# Altium schematic sheet Shuttler_AFE_Channel.SchDoc: Shuttler AFE
size 420 x 297 mm; Author: G.Kasprowicz; CompanyName: WUT ISE; DrawnBy: G.Kasprowicz; Organization: WUT ISE; Address1: PW ISE; Address2: Nowowiejska 15/19 00-665 Warsaw; Address3: gkasprow@gmail.com; DocumentNumber: 5; SheetNumber: 5; SheetTotal: 6; ModifiedBy: -; CheckedDate: -; Title2: Channel; DivGrp: WUT ISE; Designer: G.Kasprowicz; ModifiedDate: -; ProjectName: Sensor Box
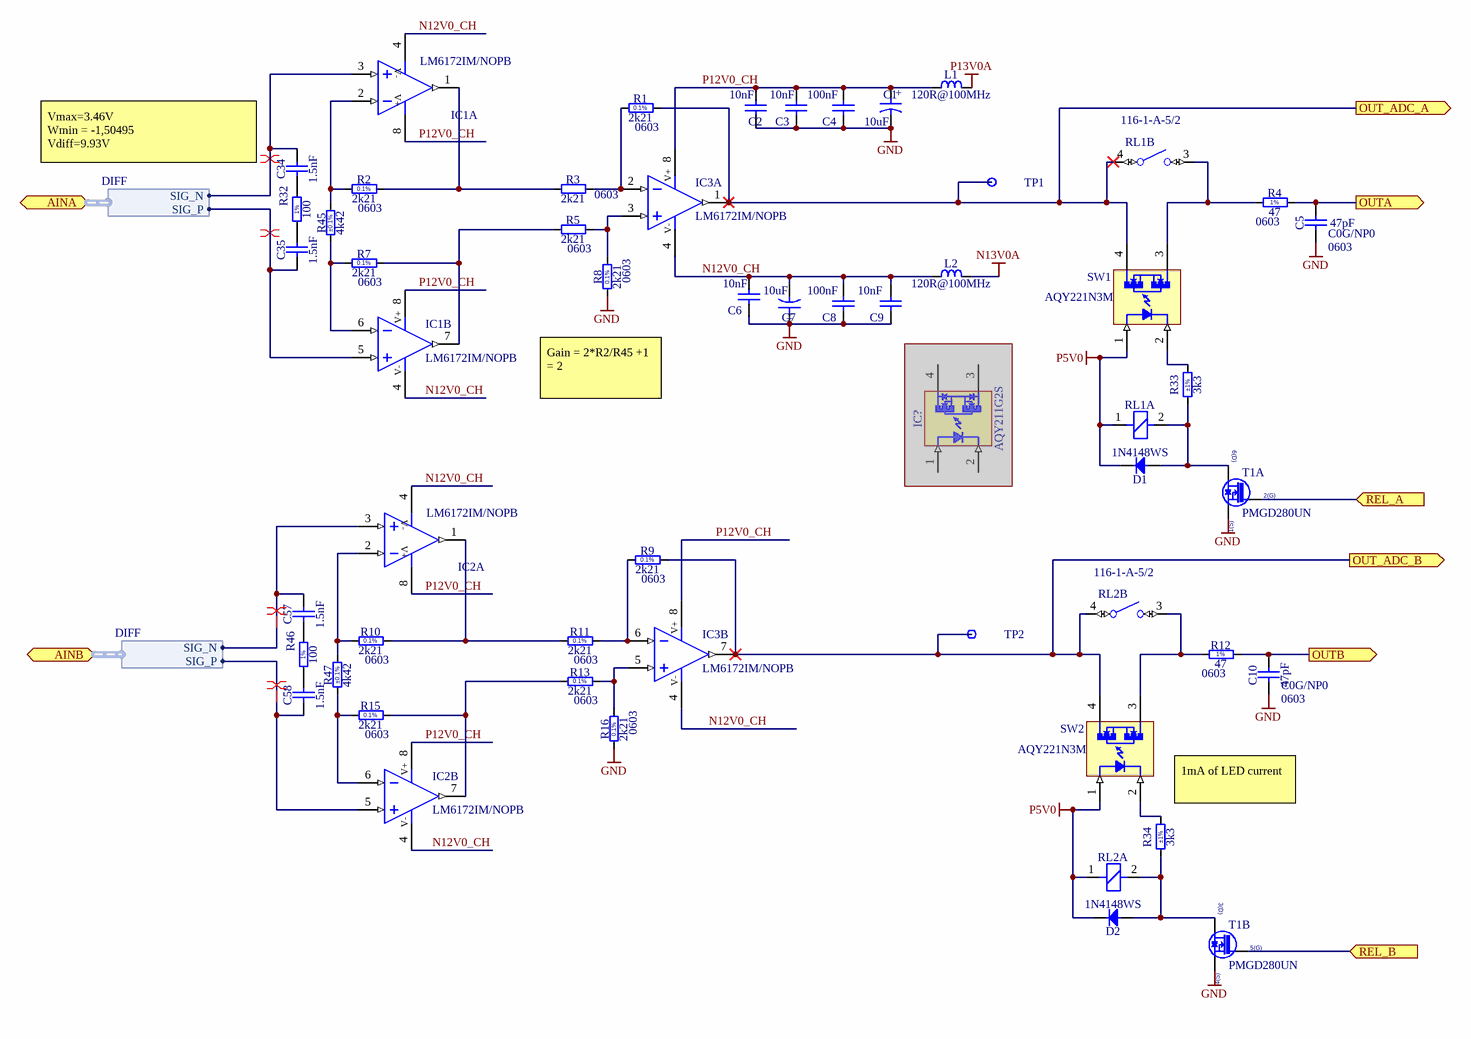
[diagram p0: Shuttler_AFE_Channel.SchDoc]

## Parts
C1  10uF  [CAPMP3216X180N]
C2  10nF  [CAPC1005X55N]
C3  10nF  [CAPC1005X55N]
C4  100nF  [CAPC1005X55N]
C5  47pF  TC: C0G/NP0  Case: 0603  [CAPC1608X87N]
C6  10nF  [CAPC1005X55N]
C7  10uF  [CAPMP3216X180N]
C8  100nF  [CAPC1005X55N]
C9  10nF  [CAPC1005X55N]
C10  47pF  TC: C0G/NP0  Case: 0603  [CAPC1608X87N]
C34  1.5nF  [CAPC1608X87N]
C35  1.5nF  [CAPC1608X87N]
C57  1.5nF  [CAPC1608X87N]
C58  1.5nF  [CAPC1608X87N]
D1  1N4148WS  [SODFL2512X100N]
D2  1N4148WS  [SODFL2512X100N]
IC1  LM6172IM/NOPB  [SOIC127P600X175-8N]  (parts A,B of 2)
IC2  LM6172IM/NOPB  [SOIC127P600X175-8N]  (parts A,B of 2)
IC3  LM6172IM/NOPB  [SOIC127P600X175-8N]  (parts A,B of 2)
IC?  AQY211G2S  [PANASONIC_AQY21(SOP)]  (masked out: inside a compile mask, not in the netlist)
L1  120R@100MHz  [INDC1608X95N]
L2  120R@100MHz  [INDC1608X95N]
R1  2k21  Case: 0603  [RESC1608X55N]
R2  2k21  Case: 0603  [RESC1608X55N]
R3  2k21  Case: 0603  [RESC1608X55N]
R4  47  Case: 0603  [RESC1608X55N]
R5  2k21  Case: 0603  [RESC1608X55N]
R7  2k21  Case: 0603  [RESC1608X55N]
R8  2k21  Case: 0603  [RESC1608X55N]
R9  2k21  Case: 0603  [RESC1608X55N]
R10  2k21  Case: 0603  [RESC1608X55N]
R11  2k21  Case: 0603  [RESC1608X55N]
R12  47  Case: 0603  [RESC1608X55N]
R13  2k21  Case: 0603  [RESC1608X55N]
R15  2k21  Case: 0603  [RESC1608X55N]
R16  2k21  Case: 0603  [RESC1608X55N]
R32  100  [RESC1608X55N]
R33  3k3  Tolerance: ±1%  [RESC1005X40N]
R34  3k3  Tolerance: ±1%  [RESC1005X40N]
R45  4k42  Tolerance: ±0.1%  [RESC1608X55N]
R46  100  [RESC1608X55N]
R47  4k42  Tolerance: ±0.1%  [RESC1608X55N]
RL1  REL_PICKERING_116-1-A-5/2  [REL_PICKERING_116-1-A]  (value not drawn)  (parts A,B of 2)
RL2  REL_PICKERING_116-1-A-5/2  [REL_PICKERING_116-1-A]  (value not drawn)  (parts A,B of 2)
SW1  AQY221N3M  [PANASONIC_AQY22(SON)]
SW2  AQY221N3M  [PANASONIC_AQY22(SON)]
T1  PMGD280UN  [SOT65P210X110-6N]  (parts A,B of 2)
TP1  Test Point  [TPS127]  (value not drawn)  (no BOM)
TP2  Test Point  [TPS127]  (value not drawn)  (no BOM)

## Ports
AINA (bidir, harness DIFF), AINB (bidir, harness DIFF), OUT_ADC_A (out), OUT_ADC_B (out), OUTA (out), OUTB (out), REL_A (in), REL_B (in)

## Harnesses
DIFF: SIG_P, SIG_N

## Nets
GND: C1.2 C2.2 C3.2 C4.2 C5.1 C6.2 C7.1 C8.2 C9.2 C10.1 R8.1 R16.1 T1.1(S) T1.4(S)
N13V0A: L2.2
P5V0: D1.1(C) D2.1(C) RL1.1(BO) RL2.1(BO) SW1.1(A) SW2.1(A)
P13V0A: L1.2
N12V0_CH: C6.1 C7.2 C8.1 C9.1 IC1.4(V-) IC2.4(V-) IC3.4(V-) L2.1
OUT_ADC_A: IC3.1(OUT) R1.2 RL1.4(C) SW1.4(E) TP1.1 ; port OUT_ADC_A
OUT_ADC_B: IC3.7(OUT) R9.2 RL2.4(C) SW2.4(E) TP2.1 ; port OUT_ADC_B
OUTA: C5.2 R4.2 ; port OUTA
OUTB: C10.2 R12.2 ; port OUTB
P12V0_CH: C1.1 C2.1 C3.1 C4.1 IC1.8(V+) IC2.8(V+) IC3.8(V+) L1.1
REL_A: T1.2(G) ; port REL_A
REL_B: T1.5(G) ; port REL_B
NetC34_1: C34.1 R32.2
NetC34_2: C34.2 IC1.3(IN+) ; port AINA.SIG_N
NetC35_1: C35.1 IC1.5(IN+) ; port AINA.SIG_P
NetC35_2: C35.2 R32.1
NetC57_1: C57.1 R46.2
NetC57_2: C57.2 IC2.3(IN+) ; port AINB.SIG_N
NetC58_1: C58.1 IC2.5(IN+) ; port AINB.SIG_P
NetC58_2: C58.2 R46.1
NetD1_2: D1.2(A) R33.1 RL1.2(BO) T1.6(D)
NetD2_2: D2.2(A) R34.1 RL2.2(BO) T1.3(D)
NetIC1_1: IC1.1(OUT) R2.2 R3.1
NetIC1_2: IC1.2(IN-) R2.1 R45.2
NetIC1_6: IC1.6(IN-) R7.1 R45.1
NetIC1_7: IC1.7(OUT) R5.1 R7.2
NetIC2_1: IC2.1(OUT) R10.2 R11.1
NetIC2_2: IC2.2(IN-) R10.1 R47.2
NetIC2_6: IC2.6(IN-) R15.1 R47.1
NetIC2_7: IC2.7(OUT) R13.1 R15.2
NetIC3_2: IC3.2(IN-) R1.1 R3.2
NetIC3_3: IC3.3(IN+) R5.2 R8.2
NetIC3_5: IC3.5(IN+) R13.2 R16.2
NetIC3_6: IC3.6(IN-) R9.1 R11.2
NetR4_1: R4.1 RL1.3(NO) SW1.3(C)
NetR12_1: R12.1 RL2.3(NO) SW2.3(C)
NetR33_2: R33.2 SW1.2(K)
NetR34_2: R34.2 SW2.2(K)

## Layout directives
differential pair: NetC34_2, NetC35_1, NetC57_2, NetC58_1

## Notes on the sheet
- Vmax=3.46V
  Wmin = -1,50495
  Vdiff=9.93V
- (near R8) Gain = 2*R2/R45 +1 = 2
- 1mA of LED current
- Project/Equipment
- Document
- Designer
- Drawn by
- Check.by
- Copyright WUT ISE 2020.
  This documentation describes Open Hardware and is licensed under the CERN OHL v.1.2. You may redistribute and modify this documentation under the terms of the CERN OHL v.1.2. (http://ohwr.org/CERNOHL). This documentation is distributed WITHOUT ANY EXPRESS OR IMPLIED WARRANTY, INCLUDING OF MERCHANTABILITY, SATISFACTORY QUALITY AND FITNESS FOR A PARTICULAR PURPOSE. Please see the CERN OHL v.1.2 for applicable conditions.
- Contact
- File
- Last Mod.
- Print Date
- Sheet
- Size
- A3
- of
- Rev
- (in symbol CTE3216-18_10UF_10V_10%_LESR1800) +
- (in symbol PMGD280UN, part A) 6(D); 2(G); 1(S)
- (in symbol PMGD280UN, part B) 3(D); 5(G); 4(S)
- (in symbol R0603_2K21_0.1%_0.063W_10PPM) 0.1%
- (in symbol R0603_47R_1%_0.1W_100PPM) 1%
- (in symbol R0603_100R_1%_0.1W_100PPM) 1%

## Library data of the parts
C1 C7 = CTE3216-18_10UF_10V_10%_LESR1800: Polarised capacitor; Part Description: Low ESR 1R8 Solid Tantalum Chip Capacitor; Manufacturer: GENERIC; Manufacturer1 Part Number: TPSA106K010R1800; Voltage: 10V; Tolerance: ±10%; Part Number: CTE3216-18_10UF_10V_10%_LESR1800; Component Kind: Standard; Component Type: Standard; Pin Count: 2; Value: 10uF; Status: Preferred; Manufacturer Part Number: CTE3216-18_10UF_10V_10%_LESR1800; Case: A; Mounted: Yes; Socket: No; SMD: Yes; Sense: No; Manufacturer1 Example: AVX; Manufacturer1 ComponentHeight: 1.8mm; HelpURL: \\cern.ch\dfs\Applications\Altium\Datasheets\CTE-LESR_AVX_TPS.pdf; Author: CERN DEM JLC; CreateDate: 05.05.2008; LatestRevisionDate: 20.01.2009
C2 C3 C6 C9 = CC0402_10NF_16V_10%_X7R: Non-polarised capacitor; Part Description: SMD Multilayer Chip Ceramic Capacitor; Manufacturer: GENERIC; Manufacturer1 Part Number: 223878715636; Voltage: 16V; TC: X7R; Tolerance: ±10%; Part Number: CC0402_10NF_16V_10%_X7R; Component Kind: Standard; Component Type: Standard; Pin Count: 2; Value: 10nF; Status: Not Recommended; Manufacturer Part Number: CC0402_10NF_16V_10%_X7R; Case: 0402; Mounted: Yes; Socket: No; SMD: Yes; Sense: No; Manufacturer1 Example: PHYCOMP; Manufacturer1 ComponentHeight: 0.55mm; HelpURL: \\cern.ch\dfs\Applications\Altium\Datasheets\CC0402_X7R_PHYCOMP.pdf; Author: CERN DEM JLC; CreateDate: 03.12.2007; LatestRevisionDate: 03.12.2007
C4 C8 = CC0402_100NF_16V_10%_X5R: Non-polarised capacitor; Part Description: SMD Multilayer Chip Ceramic Capacitor; Manufacturer: GENERIC; Manufacturer1 Part Number: GRM155R61C104KA88D; Voltage: 16V; TC: X5R; Tolerance: ±10%; Part Number: CC0402_100NF_16V_10%_X5R; Component Kind: Standard; Component Type: Standard; Pin Count: 2; Value: 100nF; Status: None; Manufacturer Part Number: CC0402_100NF_16V_10%_X5R; Case: 0402; Mounted: Yes; Socket: No; SMD: Yes; Sense: No; Manufacturer1 Example: MURATA; Manufacturer1 ComponentHeight: 0.55mm; HelpURL: \\cern.ch\dfs\Applications\Altium\Datasheets\CC0402_X5R_MURATA_GRM.pdf; Author: CERN DEM JLC; CreateDate: 10.12.2013; LatestRevisionDate: 10.12.2013
C5 C10 = CC0603_47PF_50V_5%_NP0: Non-polarised capacitor; Part Description: SMD Multilayer Chip Ceramic Capacitor; Manufacturer: GENERIC; Manufacturer1 Part Number: 223886715479; Voltage: 50V; Tolerance: ±5%; Part Number: CC0603_47PF_50V_5%_NP0; Component Kind: Standard; Component Type: Standard; Pin Count: 2; Value: 47pF; Status: Preferred; Manufacturer Part Number: CC0603_47PF_50V_5%_NP0; Mounted: Yes; Socket: No; SMD: Yes; Sense: No; Manufacturer1 Example: PHYCOMP; Manufacturer1 ComponentHeight: 0.87mm; HelpURL: \\cern.ch\dfs\Applications\Altium\Datasheets\CC0603_NP0_PHYCOMP.pdf; Author: CERN DEM JLC; CreateDate: 03.12.2007; LatestRevisionDate: 03.12.2007
C34 C35 C57 C58 = CC0603_1.5NF_50V_5%_NP0: Non-polarised capacitor; Part Description: SMD Multilayer Chip Ceramic Capacitor; Manufacturer: GENERIC; Manufacturer1 Part Number: GRM1885C1H152JA01D; Voltage: 50V; TC: C0G/NP0; Tolerance: ±5%; Part Number: CC0603_1.5NF_50V_5%_NP0; Component Kind: Standard; Component Type: Standard; Pin Count: 2; Value: 1.5nF; Status: None; Manufacturer Part Number: CC0603_1.5NF_50V_5%_NP0; Case: 0603; Mounted: Yes; Socket: No; SMD: Yes; Sense: No; Manufacturer1 Example: MURATA; Manufacturer1 ComponentHeight: 0.9mm; HelpURL: \\cern.ch\dfs\Applications\Altium\Datasheets\CC0603_NP0_MURATA.pdf; Author: CERN DEM JLC; CreateDate: 08.02.2011; LatestRevisionDate: 08.02.2011
D1 D2 = 1N4148WS: Diode; Part Description: Small Signal Diodes; Manufacturer: FAIRCHILD SEMICONDUCTOR; Voltage: 75V; Power: 150mA; PressFit: No; Bonding: No; Part Number: 1N4148WS; Component Kind: Standard; Component Type: Standard; Device: 1N4148WS; PackageDescription: SODFL Diode (SOD323F); 1.70mm W X 1.25mm L X 1.00mm H body, IPC Medium Density; Manufacturer Part Number: 1N4148WS; Pin Count: 2; Case: SOD-323F; Mounted: Yes; Socket: No; SMD: Yes; Sense: No; ComponentHeight: 1mm; HelpURL: \\cern.ch\dfs\Applications\Altium\Datasheets\1N4148WS.pdf; Author: CERN DEM JLC; CreateDate: 12.05.2011; LatestRevisionDate: 12.05.2011
IC1-IC3 = LM6172IM/NOPB: Dual Operational Amplifier; Part Description: Dual High Speed, Low Power, Low Distortion Voltage Feedback Amplifiers; Manufacturer: TEXAS INSTRUMENTS; PressFit: No; Bonding: No; Part Number: LM6172IM/NOPB; Component Kind: Standard; Component Type: Standard; Device: LM6172IM/NOPB; PackageDescription: SOIC 8, Pitch 1.27mm - Body 4x5mm, IPC Medium Density; Manufacturer Part Number: LM6172IM/NOPB; Pin Count: 8; Case: SOIC8; Mounted: Yes; Socket: No; SMD: Yes; Sense: No; ComponentHeight: 1.75mm; Author: CERN DEM MR; HelpURL: \\cern.ch\dfs\Applications\Altium\Datasheets\LM6172IM-NOPB.pdf; CreateDate: 08.08.2019; LatestRevisionDate: 08.08.2019
IC? = AQY211G2S: PhotoMOS Relay; Part Description: GU 1 Form A, PhotoMOS Relay, High Capacity, 40V 1.6A; Manufacturer: PANASONIC; PressFit: No; Bonding: No; Part Number: AQY211G2S; Component Kind: Standard; Component Type: Standard; Device: AQY211G2S; PackageDescription: PANASONIC Serie AQY21(SOP), 2.54mm Pitch; 4 Pin, 4.40mm W X 4.30mm L X 2.30mm H body; Manufacturer Part Number: AQY211G2S; Pin Count: 4; Case: SOP4; Mounted: Yes; Socket: No; SMD: Yes; Sense: No; ComponentHeight: 2.3mm; HelpURL: \\cern.ch\dfs\Applications\Altium\Datasheets\AQY211G2S.pdf; ComponentLink1Description: Package Drawing; ComponentLink1URL: \\cern.ch\dfs\Applications\Altium\Datasheets\AQY21_Package-Drawing.pdf; Author: CERN DEM BC; CreateDate: 13.10.2020; LatestRevisionDate: 13.10.2020
L1 L2 = IND0603_MURATA_BLM18PG121SN1D: Inductor; Part Description: SMD EMIFIL Chip Ferrite Bead; Manufacturer: MURATA; Power: 2A; Resistance: 0.05R; Part Number: IND0603_MURATA_BLM18PG121SN1D; Component Kind: Standard; Component Type: Standard; Pin Count: 2; Value: 120R@100MHz; Status: None; Manufacturer Part Number: BLM18PG121SN1D; Case: 0603; Mounted: Yes; Socket: No; SMD: Yes; Sense: No; ComponentHeight: 0.95mm; HelpURL: \\cern.ch\dfs\Applications\Altium\Datasheets\IND0603_MURATA_BLM18P.pdf; Author: CERN DEM BC; CreateDate: 27.07.2015; LatestRevisionDate: 27.07.2015
R1-R3 R5 R7-R11 R13 R15 R16 = R0603_2K21_0.1%_0.063W_10PPM: Resistor - 0.1%; Part Description: Thin Film Chip Resistor; Manufacturer: GENERIC; Manufacturer1 Part Number: RN73C1J2K21BTDF; Power: 0.063W; TC: ±10ppm; PressFit: No; Part Number: R0603_2K21_0.1%_0.063W_10PPM; Component Kind: Standard; Component Type: Standard; Pin Count: 2; Value: 2k21; Status: Not Recommended; Tolerance: ±0.1%; Manufacturer Part Number: R0603_2K21_0.1%_0.063W_10PPM; Mounted: Yes; Sense: No; Socket: No; SMD: Yes; Manufacturer1 Example: TYCO HOLSWORTHY; Manufacturer1 ComponentHeight: 0.5mm; HelpURL: \\cern.ch\dfs\Applications\Altium\Datasheets\R0603_Tyco_RN73.pdf; Author: CERN DEM JLC; CreateDate: 03.12.2007; LatestRevisionDate: 13.03.2008
R4 R12 = R0603_47R_1%_0.1W_100PPM: Resistor - 1%; Part Description: General Purpose Thick Film Chip Resistor; Manufacturer: GENERIC; Manufacturer1 Part Number: NRC06F47R0TRF; Power: 0.1W; TC: ±100ppm/°C; PressFit: No; Part Number: R0603_47R_1%_0.1W_100PPM; Component Kind: Standard; Component Type: Standard; Pin Count: 2; Value: 47; Status: Preferred; Tolerance: ±1%; Manufacturer Part Number: R0603_47R_1%_0.1W_100PPM; Mounted: Yes; Sense: No; Socket: No; SMD: Yes; Manufacturer1 Example: NIC COMPONENT; Manufacturer1 ComponentHeight: 0.55mm; HelpURL: \\cern.ch\dfs\Applications\Altium\Datasheets\R0603_NIC_NRC.pdf; Author: CERN DEM JLC; CreateDate: 03.12.2007; LatestRevisionDate: 13.03.2008
R32 R46 = R0603_100R_1%_0.1W_100PPM: Resistor - 1%; Part Description: General Purpose Thick Film Chip Resistor; Manufacturer: GENERIC; Manufacturer1 Part Number: NRC06F4700TRF; Power: 0.1W; TC: ±100ppm/°C; PressFit: No; Part Number: R0603_100R_1%_0.1W_100PPM; Component Kind: Standard; Component Type: Standard; Pin Count: 2; Value: 100; Status: Preferred; Tolerance: ±1%; Manufacturer Part Number: R0603_100R_1%_0.1W_100PPM; Case: 0603; Mounted: Yes; Sense: No; Socket: No; SMD: Yes; Manufacturer1 Example: NIC COMPONENT; Manufacturer1 ComponentHeight: 0.55mm; HelpURL: \\cern.ch\dfs\Applications\Altium\Datasheets\R0603_NIC_NRC.pdf; Author: CERN DEM JLC; CreateDate: 03.12.2007; LatestRevisionDate: 13.03.2008
R33 R34 = R0402_3K3_1%_0.0625W_100PPM: Resistor - 1%; Part Description: General Purpose Thick Film Chip Resistor; Manufacturer: GENERIC; Manufacturer1 Part Number: 232270673302L; TC: ±100ppm/°C; PressFit: No; Part Number: R0402_3K3_1%_0.0625W_100PPM; Component Kind: Standard; Component Type: Standard; Pin Count: 2; Value: 3k3; Status: Not Recommended; Power: 0.0625W; Manufacturer Part Number: R0402_3K3_1%_0.0625W_100PPM; Case: 0402; Mounted: Yes; Sense: No; Socket: No; SMD: Yes; Manufacturer1 Example: YAGEO PHYCOMP; Manufacturer1 ComponentHeight: 0.4mm; HelpURL: \\cern.ch\dfs\Applications\Altium\Datasheets\R0402_Phycomp_RC0402.pdf; Author: CERN DEM JLC; CreateDate: 03.12.2007; LatestRevisionDate: 17.10.2012
R45 R47 = R0603_4K42_0.1%_0.063W_10PPM: Resistor - 0.1%; Part Description: Thin Film Chip Resistor; Manufacturer: GENERIC; Manufacturer1 Part Number: RN73C1J4K42BTDF; Power: 0.063W; TC: ±10ppm; PressFit: No; Part Number: R0603_4K42_0.1%_0.063W_10PPM; Component Kind: Standard; Component Type: Standard; Pin Count: 2; Value: 4k42; Status: Not Recommended; Manufacturer Part Number: R0603_4K42_0.1%_0.063W_10PPM; Case: 0603; Mounted: Yes; Sense: No; Socket: No; SMD: Yes; Manufacturer1 Example: TYCO HOLSWORTHY; Manufacturer1 ComponentHeight: 0.5mm; HelpURL: \\cern.ch\dfs\Applications\Altium\Datasheets\R0603_Tyco_RN73.pdf; Author: CERN DEM JLC; CreateDate: 03.12.2007; LatestRevisionDate: 13.03.2008
RL1 RL2 = REL_PICKERING_116-1-A-5/2: SPST (1 Form A) Very High Packing Density SIL Reed Relay, 116 Serie; Part Description: SPST (1 Form A) Very High Packing Density SIL Reed Relay, 116 Series; Manufacturer: PICKERING ELECTRONICS; PressFit: No; Value: 5VDC; Part Number: REL_PICKERING_116-1-A-5/2; Component Kind: Standard; Component Type: Standard; Pin Count: 8; PackageDescription: 4 Leads, Body 6.86 x 3.81mm, 1Form A SIL Reed Relay, 116 Series; Mounted: Yes; Socket: No; SMD: No; Sense: No; Status: None; Manufacturer Part Number: 116-1-A-5/2; ComponentHeight: 12.6mm; HelpURL: \\cern.ch\dfs\Applications\Altium\Datasheets\REL_PICKERING_116.pdf; Author: CERN DEM JLC; CreateDate: 31.05.2011; LatestRevisionDate: 07.03.2017
SW1 SW2 = AQY221N3M: PhotoMOS Relay; Part Description: Micro-miniature SON Package Lower Output Capacitance and On Resistance (C×R5) 25V Load Voltage PhotoMOS Relay; Manufacturer: PANASONIC ELECTRIC WORKS; Table: Optocouplers; Part Number: AQY221N3M; Component Kind: Standard; Component Type: Standard; Device: AQY221N3M; PackageDescription: PANASONIC Serie AQY22(SON)  Small Outline No Lead, 4 pins, 2.2x2.95mm; Manufacturer Part Number: AQY221N3M; Pin Count: 4; Case: SON4; Mounted: Yes; Socket: No; SMD: Yes; ComponentHeight: 1.4mm; HelpURL: \\cern.ch\dfs\Applications\Altium\Datasheets\AQY221N3M.pdf; ComponentLink1Description: Package Drawing; ComponentLink1URL: \\cern.ch\dfs\Applications\Altium\Datasheets\AQY221N3M_Package-Drawing.pdf; Author: CERN DEM JLC; CreateDate: 18/01/2010; LatestRevisionDate: 18/01/2010
T1 = PMGD280UN: Dual N-Channel micro TrenchMOS™ Ultra Low Level FET; Part Description: 20V 870mA Dual N-Channel micro TrenchMOS™ Ultra Low Level FET; Manufacturer: NXP SEMICONDUCTORS; PressFit: No; Bonding: No; Part Number: PMGD280UN; Component Kind: Standard; Component Type: Standard; Device: PMGD280UN; PackageDescription: SOT363, SC70-6, 0.65mm Pitch; 6 Pin, 1.25mm W X 2.00mm L X 1.10mm H body, IPC Medium Density; Manufacturer Part Number: PMGD280UN; Pin Count: 6; Case: SOT363; Mounted: Yes; Socket: No; SMD: Yes; Sense: No; ComponentHeight: 1.1mm; HelpURL: \\cern.ch\dfs\Applications\Altium\Datasheets\PMGD280UN.pdf; Author: CERN DEM JLC; CreateDate: 19.11.2014; LatestRevisionDate: 19.11.2014
TP1 TP2 = SMD_PAD_1.27X1.27MM: Part Description: 1.27mm x 1.27mm PCB Copper Area (SMD Test Point); Mounted: No; Part Number: SMD_PAD_1.27X1.27MM; Component Type: Standard (No BOM); Pin Count: 1; Family: Test Point; Socket: No; SMD: No; Sense: No; Status: None; ComponentHeight: 0mm; HelpURL: Undefined; Author: CERN DEM JLC; CreateDate: 12.01.2008; LatestRevisionDate: 12.01.2008; PackageDescription: 1.27mm x 1.27mm PCB Copper Area (SMD Test Point)